# Altium schematic sheet UPC.SchDoc
size A4
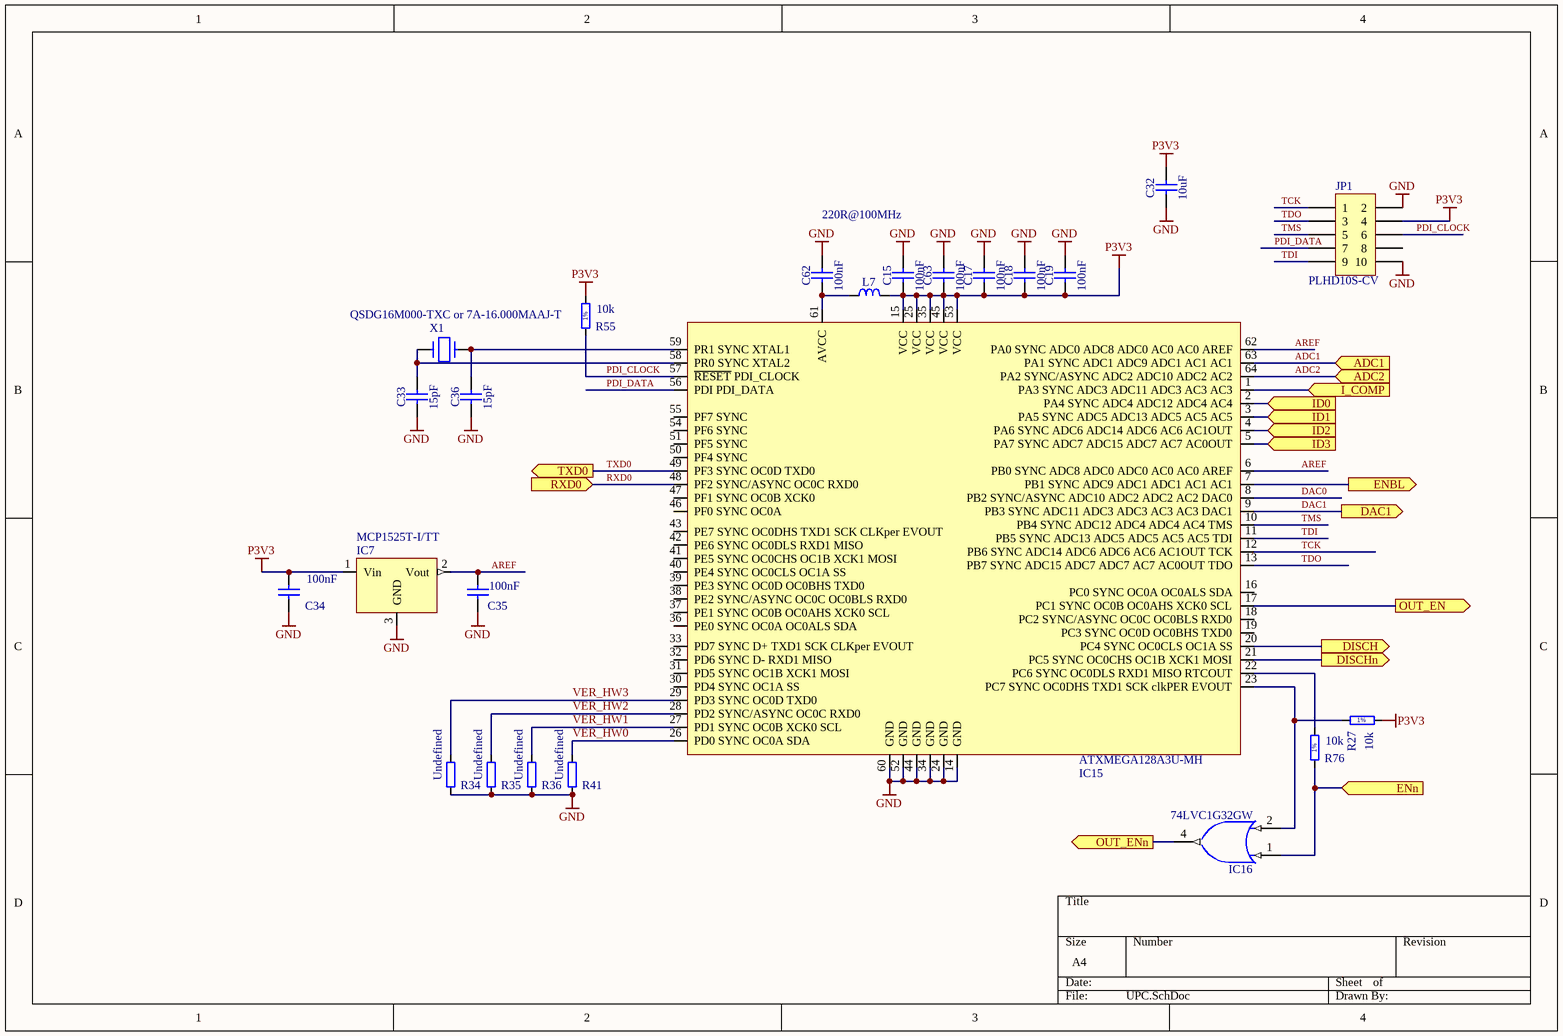
[diagram p0: UPC.SchDoc]

## Parts
C15  100nF  [CAPC1005X55N]
C17  100nF  [CAPC1005X55N]
C18  100nF  [CAPC1005X55N]
C19  100nF  [CAPC1005X55N]
C32  10uF  [CAPC2012X135N]
C33  15pF  [CAPC1005X55N]
C34  100nF  [CAPC1005X55N]
C35  100nF  [CAPC1005X55N]
C36  15pF  [CAPC1005X55N]
C62  100nF  [CAPC1005X55N]
C63  100nF  [CAPC1005X55N]
IC7  MCP1525T-I/TT  [SOT95P251X112-3N]
IC15  ATXMEGA128A3U-MH  [QFN64]
IC16  74LVC1G32GW  [SOT65P212X110-5N]
JP1  PLHD10S-CV  [CON_2x5_MINI]
L7  220R@100MHz  [INDC1005X55N]
R27  10k  [RESC1005X40N]
R34  Undefined  [RESC1005X40N]
R35  Undefined  [RESC1005X40N]
R36  Undefined  [RESC1005X40N]
R41  Undefined  [RESC1005X40N]
R55  10k  [RESC1005X40N]
R76  10k  [RESC1005X40N]
X1  QSDG16M000-TXC or 7A-16.000MAAJ-T  [XTAL_5.0*3.2]

## Ports
ADC1 (in), ADC2 (in), DAC1 (out), DISCH (out), DISCHn (out), ENBL (out), ENn (in), I_COMP (in), ID0 (in), ID1 (in), ID2 (in), ID3 (in), OUT_EN (out), OUT_ENn (out), RXD0 (in), TXD0 (out)

## Nets
GND: C15.2 C17.2 C18.2 C19.2 C32.1 C33.1 C34.1 C35.1 C36.1 C62.2 C63.2 IC7.3(GND) IC15.14(GND) IC15.24(GND) IC15.34(GND) IC15.44(GND) IC15.52(GND) IC15.60(GND) IC16.3(GND) JP1.2 JP1.10 R34.1 R35.1 R36.1 R41.1
P3V3: C15.1 C17.1 C18.1 C19.1 C32.2 C34.2 C63.1 IC7.1(Vin) IC15.15(VCC) IC15.25(VCC) IC15.35(VCC) IC15.45(VCC) IC15.53(VCC) IC16.5(VCC) JP1.4 L7.2 R27.2 R55.2
ADC1: IC15.63(PA1_SYNC_ADC1_ADC9_ADC1_AC1_AC1) ; port ADC1
ADC2: IC15.64(PA2_SYNC/ASYNC_ADC2_ADC10_ADC2_AC2) ; port ADC2
AREF: C35.2 IC7.2(Vout) IC15.6(PB0_SYNC_ADC8_ADC0_ADC0_AC0_AC0_AREF) IC15.62(PA0_SYNC_ADC0_ADC8_ADC0_AC0_AC0_AREF)
DAC0: IC15.8(PB2_SYNC/ASYNC_ADC10_ADC2_ADC2_AC2_DAC0)
DAC1: IC15.9(PB3_SYNC_ADC11_ADC3_ADC3_AC3_AC3_DAC1) ; port DAC1
DISCH: IC15.20(PC4_SYNC_OC0CLS_OC1A_SS) ; port DISCH
DISCHn: IC15.21(PC5_SYNC_OC0CHS_OC1B_XCK1_MOSI) ; port DISCHn
ENBL: IC15.7(PB1_SYNC_ADC9_ADC1_ADC1_AC1_AC1) ; port ENBL
ENn: IC16.1(A) R76.1 ; port ENn
I_COMP: IC15.1(PA3_SYNC_ADC3_ADC11_ADC3_AC3_AC3) ; port I_COMP
ID0: IC15.2(PA4_SYNC_ADC4_ADC12_ADC4_AC4) ; port ID0
ID1: IC15.3(PA5_SYNC_ADC5_ADC13_ADC5_AC5_AC5) ; port ID1
ID2: IC15.4(PA6_SYNC_ADC6_ADC14_ADC6_AC6_AC1OUT) ; port ID2
ID3: IC15.5(PA7_SYNC_ADC7_ADC15_ADC7_AC7_AC0OUT) ; port ID3
OUT_EN: IC15.17(PC1_SYNC_OC0B_OC0AHS_XCK0_SCL) ; port OUT_EN
OUT_ENn: IC16.4(Y) ; port OUT_ENn
PDI_CLOCK: IC15.57(~{RESET}_PDI_CLOCK) JP1.6 R55.1
PDI_DATA: IC15.56(PDI_PDI_DATA) JP1.7
RXD0: IC15.48(PF2_SYNC/ASYNC_OC0C_RXD0) ; port RXD0
TCK: IC15.12(PB6_SYNC_ADC14_ADC6_ADC6_AC6_AC1OUT_TCK) JP1.1
TDI: IC15.11(PB5_SYNC_ADC13_ADC5_ADC5_AC5_AC5_TDI) JP1.9
TDO: IC15.13(PB7_SYNC_ADC15_ADC7_ADC7_AC7_AC0OUT_TDO) JP1.3
TMS: IC15.10(PB4_SYNC_ADC12_ADC4_ADC4_AC4_TMS) JP1.5
TXD0: IC15.49(PF3_SYNC_OC0D_TXD0) ; port TXD0
VER_HW0: IC15.26(PD0_SYNC_OC0A_SDA) R41.2
VER_HW1: IC15.27(PD1_SYNC_OC0B_XCK0_SCL) R36.2
VER_HW2: IC15.28(PD2_SYNC/ASYNC_OC0C_RXD0) R35.2
VER_HW3: IC15.29(PD3_SYNC_OC0D_TXD0) R34.2
NetC33_2: C33.2 IC15.58(PR0_SYNC_XTAL2) X1.2
NetC36_2: C36.2 IC15.59(PR1_SYNC_XTAL1) X1.1
NetC62_1: C62.1 IC15.61(AVCC) L7.1
NetIC15_22: IC15.22(PC6_SYNC_OC0DLS_RXD1_MISO_RTCOUT) R76.2
NetIC15_23: IC15.23(PC7_SYNC_OC0DHS_TXD1_SCK_clkPER_EVOUT) IC16.2(B) R27.1

Not connected (* = marked no-connect by the designer): IC15 16(PC0_SYNC_OC0A_OC0ALS_SDA) 18(PC2_SYNC/ASYNC_OC0C_OC0BLS_RXD0) 19(PC3_SYNC_OC0D_OC0BHS_TXD0) 30(PD4_SYNC_OC1A_SS) 31(PD5_SYNC_OC1B_XCK1_MOSI) 32(PD6_SYNC_D-_RXD1_MISO) 33(PD7_SYNC_D+_TXD1_SCK_CLKper_EVOUT) 36(PE0_SYNC_OC0A_OC0ALS_SDA) 37(PE1_SYNC_OC0B_OC0AHS_XCK0_SCL) 38(PE2_SYNC/ASYNC_OC0C_OC0BLS_RXD0) 39(PE3_SYNC_OC0D_OC0BHS_TXD0) 40(PE4_SYNC_OC0CLS_OC1A_SS) 41(PE5_SYNC_OC0CHS_OC1B_XCK1_MOSI) 42(PE6_SYNC_OC0DLS_RXD1_MISO) 43(PE7_SYNC_OC0DHS_TXD1_SCK_CLKper_EVOUT) 46(PF0_SYNC_OC0A) 47(PF1_SYNC_OC0B_XCK0) 50(PF4_SYNC) 51(PF5_SYNC) 54(PF6_SYNC) 55(PF7_SYNC); JP1 8

## Notes on the sheet
- (in symbol R0402_10K_1%_0.0625W_100PPM) 1%

## Library data of the parts
C15 C17-C19 C34 C35 C62 C63 = CC0402_100NF_16V_10%_X7R: Non-polarised capacitor; Part Description: SMD Multilayer Chip Ceramic Capacitor; Manufacturer: GENERIC; Manufacturer1 Part Number: GRM155R71C104KA88D; Voltage: 16V; TC: X7R; Tolerance: ±10%; Part Number: CC0402_100NF_16V_10%_X7R; Component Kind: Standard; Component Type: Standard; Pin Count: 2; Value: 100nF; Status: Not Recommended; Manufacturer Part Number: CC0402_100NF_16V_10%_X7R; Case: 0402; Mounted: Yes; Socket: No; SMD: Yes; Sense: No; Manufacturer1 Example: MURATA; Manufacturer1 ComponentHeight: 0.55mm; HelpURL: \\cern.ch\dfs\Applications\Altium\Datasheets\CC0402_X7R_MURATA_GRM.pdf; Author: CERN DEM JLC; CreateDate: 2013-12-05; LatestRevisionDate: 2007-12-03
C32 = CC0805_10UF_16V_10%_X5R: Non-polarised capacitor; Part Description: SMD Multilayer Chip Ceramic Capacitor; Manufacturer: GENERIC; Manufacturer1 Part Number: C0805C106K4PAC; Voltage: 16V; TC: X5R; Tolerance: ±10%; Part Number: CC0805_10UF_16V_10%_X5R; Component Kind: Standard; Component Type: Standard; Pin Count: 2; Value: 10uF; Status: Preferred; Manufacturer Part Number: CC0805_10UF_16V_10%_X5R; Case: 0805; Mounted: Yes; Socket: No; SMD: Yes; Sense: No; Manufacturer1 Example: KEMET; Manufacturer1 ComponentHeight: 1.4mm; HelpURL: \\cern.ch\dfs\Applications\Altium\Datasheets\CC1206_X5R_KEMET.pdf; Author: CERN DEM JLC; CreateDate: 2007-12-03; LatestRevisionDate: 2007-12-03
C33 C36 = CC0402_15PF_50V_5%_C0G: Non-polarised capacitor; Part Description: SMD Multilayer Chip Ceramic Capacitor; Manufacturer: GENERIC; Manufacturer1 Part Number: C0402C150J5GACTU; Voltage: 50V; TC: C0G/NP0; Tolerance: ±5%; Part Number: CC0402_15PF_50V_5%_C0G; Component Kind: Standard; Component Type: Standard; Pin Count: 2; Value: 15pF; Status: Preferred; Manufacturer Part Number: CC0402_15PF_50V_5%_C0G; Case: 0402; Mounted: Yes; Socket: No; SMD: Yes; Sense: No; Manufacturer1 Example: KEMET; Manufacturer1 ComponentHeight: 0.55mm; HelpURL: \\cern.ch\dfs\Applications\Altium\Datasheets\CC0805_C0G_KEMET_(Commercial Grade).pdf; Author: CERN DEM JLC; CreateDate: 2007-12-03; LatestRevisionDate: 2015-04-22
IC7 = REF_MCP1525: 2.5 voltage reference
IC15 = ATXMEGA128: 8/16-bit Atmel  XMEGA A3U  Microcontroller
IC16 = 74LVC1G32GW: Single 2-Input Positive-OR Gate; Part Description: Single 2-input OR gate; Manufacturer: NXP SEMICONDUCTORS; PressFit: No; Bonding: No; Part Number: 74LVC1G32GW; Component Kind: Standard; Component Type: Standard; Device: 74LVC1G32GW; PackageDescription: SOT353, SOT, 0.65mm Pitch, 5 pin, 1.25mm W X 2.05mm L X 1.10mm H, IPC Medium Density; Manufacturer Part Number: 74LVC1G32GW; Pin Count: 5; Case: SOT353; Mounted: Yes; Socket: No; SMD: Yes; Sense: No; ComponentHeight: 1.1mm; Author: CERN DEM JLC; HelpURL: \\cern.ch\dfs\Applications\Altium\Datasheets\74LVC1G32GW.pdf; CreateDate: 2013-11-25; LatestRevisionDate: 2013-11-25
JP1 = CON_2x5 1.27 male: Goldpin 1.27mm
L7 = IND0402_MURATA_BLM15HB221SN1: Inductor; Part Description: SMD EMIFIL Suppression Chip Ferrite Bead; Manufacturer: MURATA; Power: 250mA; Resistance: 1R; Tolerance: ±25%; Part Number: IND0402_MURATA_BLM15HB221SN1; Component Kind: Standard; Component Type: Standard; Pin Count: 2; Value: 220R@100MHz; Status: None; Manufacturer Part Number: BLM15HB221SN1; Case: 0402; Mounted: Yes; Socket: No; SMD: Yes; Sense: No; ComponentHeight: 0.55mm; HelpURL: \\cern.ch\dfs\Applications\Altium\Datasheets\IND0402_MURATA_BLM15H.pdf; Author: CERN DEM JLC; CreateDate: 2009-06-23; LatestRevisionDate: 2009-06-23
R27 R55 R76 = R0402_10K_1%_0.0625W_100PPM: Resistor - 1%; Part Description: General Purpose Thick Film Chip Resistor; Manufacturer: GENERIC; Manufacturer1 Part Number: 232270671003L; TC: ±100ppm/°C; Part Number: R0402_10K_1%_0.0625W_100PPM; Component Kind: Standard; Component Type: Standard; Pin Count: 2; Value: 10k; Status: Not recommended; Power: 0.0625W; Tolerance: ±1%; Manufacturer Part Number: R0402_10K_1%_0.0625W_100PPM; Case: 0402; Mounted: Yes; Sense: No; Socket: No; SMD: Yes; Manufacturer1 Example: YAGEO PHYCOMP; Manufacturer1 ComponentHeight: 0.4mm; HelpURL: \\cern.ch\dfs\Applications\Altium\Datasheets\R0402_Phycomp_RC0402.pdf; Author: CERN DEM JLC; CreateDate: 2007-12-03; LatestRevisionDate: 2012-10-17
R34-R36 R41 = R0402_NO-VALUE: Resistor; Part Description: Reserved Footprint For a 0402 (1005) Chip Resistor; Mounted: No; Part Number: R0402_NO-VALUE; Component Kind: Standard; Component Type: Standard; Pin Count: 2; Value: Undefined; Status: None; Manufacturer: Undefined; Manufacturer Part Number: R0402_NO-VALUE; Case: 0402; Sense: No; Socket: No; SMD: Yes; Manufacturer1 Example: Undefined; Manufacturer1 Part Number: Undefined; Manufacturer1 ComponentHeight: Undefined; HelpURL: Undefined; Author: CERN DEM JLC; CreateDate: 2007-12-03; LatestRevisionDate: 2008-03-13
X1 = X_CRYSTAL_SMD_5.0*3.2_16M: miniature crystal oscillator (Maritex); Supplier 1: Digi-Key; Supplier Part Number 1: 887-1086-1-ND